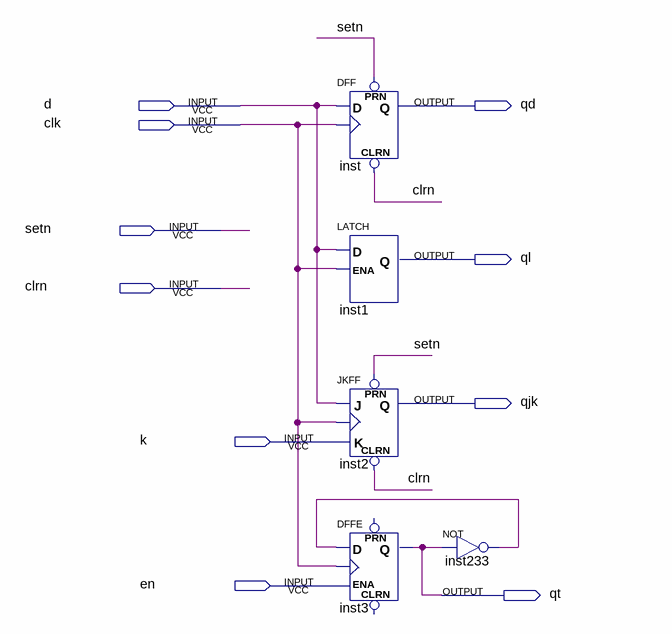
[diagram p0: schematic sheet]
// Quartus schematic testff.bdf as structural Verilog: 5 symbols, 10 pins
module testff (
  input  d,
  input  clk,
  input  setn,
  input  clrn,
  input  k,
  input  en,
  output qd,
  output ql,
  output qjk,
  output qt
);

  wire inst233_out;

  DFF inst (.CLRN(clrn), .CLK(clk), .D(d), .PRN(setn), .Q(qd));
  LATCH inst1 (.D(d), .ENA(clk), .Q(ql));
  JKFF inst2 (.PRN(setn), .CLRN(clrn), .K(k), .J(d), .CLK(clk), .Q(qjk));
  DFFE inst3 (.D(inst233_out), .CLK(clk), .ENA(en), .Q(qt));  // open: PRN, CLRN
  not inst233 (inst233_out, qt);
endmodule
